# Altium schematic sheet 485Driver_MAX3462.SchDoc
size A4
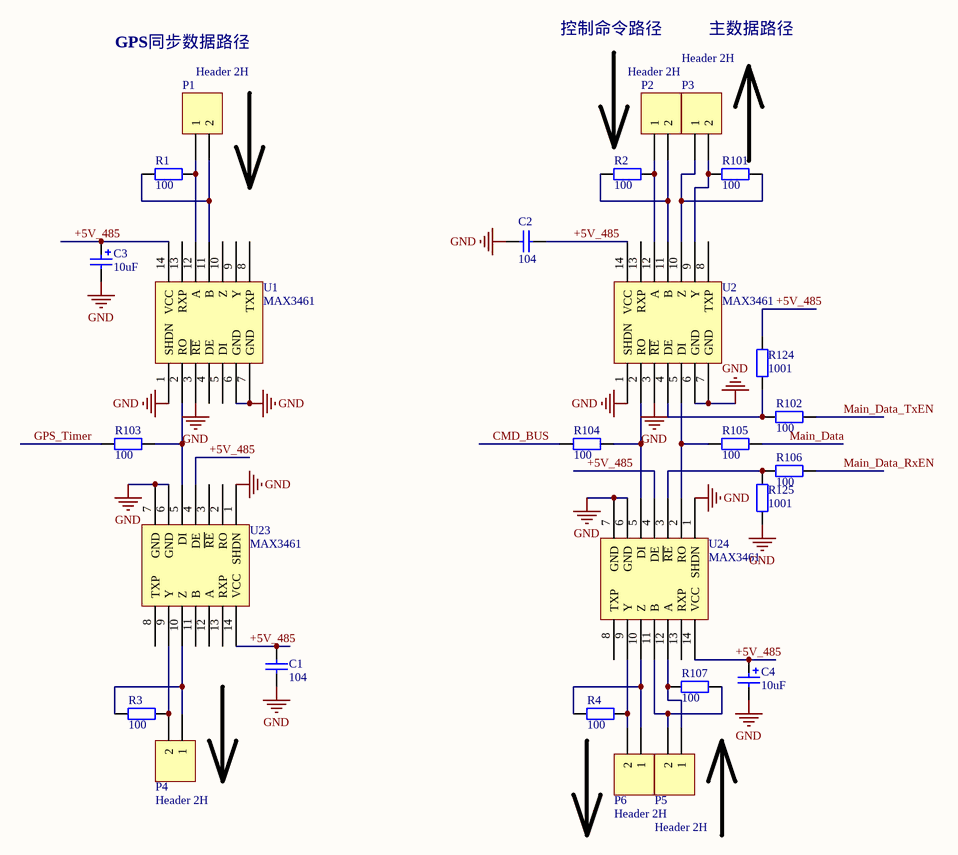
[diagram p0: 485Driver_MAX3462.SchDoc]

## Parts
C1  104  [0805C]
C2  104  [0805C]
C3  10uF  [C68uF]
C4  10uF  [C68uF]
P1  Header 2H  [HDR1X2]
P2  Header 2H  [HDR1X2]
P3  Header 2H  [HDR1X2]
P4  Header 2H  [HDR1X2]
P5  Header 2H  [HDR1X2]
P6  Header 2H  [HDR1X2]
R1  100  [0805R]
R2  100  [0805R]
R3  100  [0805R]
R4  100  [0805R]
R101  100  [0805R]
R102  100  [0603]
R103  100  [0603]
R104  100  [0603]
R105  100  [0603]
R106  100  [0603]
R107  100  [0805R]
R124  1001  [0603]
R125  1001  [0603]
U1  MAX3461  [SOP14]
U2  MAX3461  [SOP14]
U23  MAX3461  [SOP14]
U24  MAX3461  [SOP14]

## Nets
GND: C1.1 C2.1 C3.2 C4.2 R125.2 U1.1(SHDN) U1.3(~{RE}) U1.6(GND) U1.7(GND) U2.1(SHDN) U2.3(~{RE}) U2.6(GND) U2.7(GND) U23.1(SHDN) U23.6(GND) U23.7(GND) U24.1(SHDN) U24.6(GND) U24.7(GND)
+5V_485: C1.2 C2.2 C3.1 C4.1 R124.1 U1.14(VCC) U2.14(VCC) U23.4(DE) U23.14(VCC) U24.4(DE) U24.14(VCC)
CMD_BUS: R104.2
GPS_Timer: R103.2
Main_Data: R105.1
Main_Data_RxEN: R106.1
Main_Data_TxEN: R102.1
NetP1_1: P1.1 R1.1 U1.12(A)
NetP1_2: P1.2 R1.2 U1.11(B)
NetP2_1: P2.1 R2.1 U2.12(A)
NetP2_2: P2.2 R2.2 U2.11(B)
NetP3_1: P3.1 R101.1 U2.10(Z)
NetP3_2: P3.2 R101.2 U2.9(Y)
NetP4_1: P4.1 R3.2 U23.10(Z)
NetP4_2: P4.2 R3.1 U23.9(Y)
NetP5_1: P5.1 R107.2 U24.12(A)
NetP5_2: P5.2 R107.1 U24.11(B)
NetP6_1: P6.1 R4.2 U24.10(Z)
NetP6_2: P6.2 R4.1 U24.9(Y)
NetR102_2: R102.2 R124.2 U2.4(DE)
NetR103_1: R103.1 U1.2(RO) U23.5(DI)
NetR104_1: R104.1 U2.2(RO) U24.5(DI)
NetR105_2: R105.2 U2.5(DI) U24.2(RO)
NetR106_2: R106.2 R125.1 U24.3(~{RE})

Not connected (* = marked no-connect by the designer): U1 4(DE) 5(DI) 8(TXP) 9(Y) 10(Z) 13(RXP); U2 8(TXP) 13(RXP); U23 2(RO) 3(~{RE}) 8(TXP) 11(B) 12(A) 13(RXP); U24 8(TXP) 13(RXP)

## Notes on the sheet
- 控制命令路径
- 主数据路径
- GPS同步数据路径

## Library data of the parts
C1 C2 = Cap: Capacitor; Value: 100nF; Published: 8-Jun-2000; LatestRevisionDate: 17-Jul-2002; LatestRevisionNote: Re-released for DXP Platform.; PackageReference: RAD-0.3; Publisher: Altium Limited
C3 C4 = Cap Pol2: Polarized Capacitor (Axial); Value: 100pF; Published: 8-Jun-2000; LatestRevisionDate: 17-Jul-2002; LatestRevisionNote: Re-released for DXP Platform.; PackageReference: POLAR0.8; Publisher: Altium Limited
P1-P6 = Header 2H: Header, 2-Pin, Right Angle; LatestRevisionDate: 17-Jul-2002; LatestRevisionNote: Re-released for DXP Platform.; Publisher: Altium Limited
R1-R4 R101-R107 R124 R125 = Res2: Resistor; Value: 1K; Published: 8-Jun-2000; LatestRevisionDate: 17-Jul-2002; LatestRevisionNote: Re-released for DXP Platform.; PackageReference: AXIAL-0.4; Publisher: Altium Limited